# Altium schematic sheet Switcher_Charger.SchDoc
size B
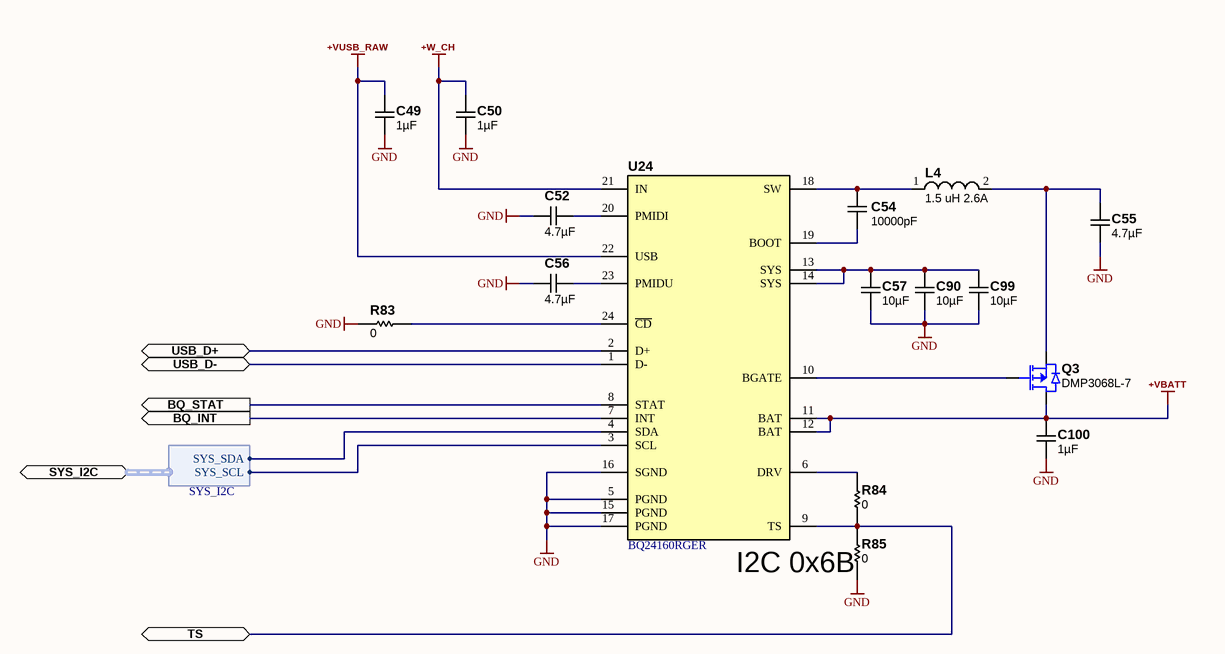
[diagram p0: Switcher_Charger.SchDoc]

## Parts
C49  1µF  [C0603_0.90MM_MD]
C50  1µF  [C0603_0.90MM_MD]
C52  4.7µF  [C0805_1.45MM_MD]
C54  10000pF  [C0603_0.90MM_MD]
C55  4.7µF  [C0805_1.45MM_MD]
C56  4.7µF  [C0805_1.45MM_MD]
C57  10µF  [C0805_1.40MM_MD]
C90  10µF  [C0805_1.40MM_MD]
C99  10µF  [C0805_1.40MM_MD]
C100  1µF  [C0603_0.90MM_MD]
L4  1.5 uH 2.6A  [L_DO1608C]
Q3  DMP3068L-7  [SOT-23]
R83  0  [R0603_0.55MM_MD]
R84  0  [R0603_0.55MM_MD]
R85  0  [R0603_0.55MM_MD]
U24  BQ24160RGER  [QFN50P400X400X100_HS-25N]

## Ports
BQ_INT (out), BQ_STAT (out), SYS_I2C (bidir, harness SYS_I2C), TS (bidir), USB_D+ (bidir), USB_D- (bidir)

## Harnesses
SYS_I2C: SYS_SCL, SYS_SDA

## Nets
+VBATT: C100.2 Q3.3(D) U24.11(BAT) U24.12(BAT)
+VUSB_RAW: C49.2 U24.22(USB)
+W_CH: C50.2 U24.21(IN)
GND: C49.1 C50.1 C52.2 C55.1 C56.2 C57.1 C90.1 C99.1 C100.1 R83.2 R85.1 U24.5(PGND) U24.15(PGND) U24.16(SGND) U24.17(PGND)
BQ_INT: U24.7(INT) ; port BQ_INT
BQ_STAT: U24.8(STAT) ; port BQ_STAT
TS: R84.1 R85.2 U24.9(TS) ; port TS
USB_D+: U24.2(D+) ; port USB_D+
USB_D-: U24.1(D-) ; port USB_D-
NetC52_1: C52.1 U24.20(PMIDI)
NetC54_1: C54.1 U24.19(BOOT)
NetC54_2: C54.2 L4.1 U24.18(SW)
NetC55_2: C55.2 L4.2 Q3.2(S)
NetC56_1: C56.1 U24.23(PMIDU)
NetC57_2: C57.2 C90.2 C99.2 U24.13(SYS) U24.14(SYS)
NetQ3_1: Q3.1(G) U24.10(BGATE)
NetR83_1: R83.1 U24.24(~{CD})
NetR84_2: R84.2 U24.6(DRV)
NetU24_3: U24.3(SCL) ; port SYS_I2C.SYS_SCL
NetU24_4: U24.4(SDA) ; port SYS_I2C.SYS_SDA

## Notes on the sheet
- (near U24) I2C 0x6B

## Library data of the parts
C49 C50 C100 = CGA3E1X7R1C105K080AC: CAP CER 1UF 16V X7R 0603; Manufacturer: TDK Corporation; Tolerance: ±10%; Substitution Notes: 1µF , 16V , ±10% , X7R , -55°C ~ 125°C , AEC-Q200 , 0603; Value: 1µF; Temperature Coefficient: X7R; Manufacturer Part Number: CGA3E1X7R1C105K080AC; ComponentLink1Description: Datasheet (Internal); ComponentLink1URL: datasheets\TDK\mlcc_automotive_general_en.pdf; ComponentLink2Description: Datasheet (External); ComponentLink2URL: https://product.tdk.com/info/en/catalog/datasheets/mlcc_automotive_general_en.pdf; Supplier 1: Digikey; Supplier Part Number 1: 445-12539-1-ND; Category: Capacitors; Voltage - Rated: 16V; Features: -; Operating Temperature: -55°C ~ 125°C; Ratings: AEC-Q200; Package: 0603; Thickness (Max): 0.90MM
C52 C55 C56 = CGA4J3X7R1C475K125AB: CAP CER 4.7UF 16V X7R 0805; Manufacturer: TDK Corporation; Tolerance: ±10%; Substitution Notes: 4.7µF , 16V , ±10% , X7R , -55°C ~ 125°C , AEC-Q200 , 0805; Value: 4.7µF; Temperature Coefficient: X7R; Manufacturer Part Number: CGA4J3X7R1C475K125AB; ComponentLink1Description: Datasheet (Internal); ComponentLink1URL: datasheets\TDK\mlcc_automotive_general_en.pdf; ComponentLink2Description: Datasheet (External); ComponentLink2URL: https://product.tdk.com/info/en/catalog/datasheets/mlcc_automotive_general_en.pdf; Supplier 1: Digikey; Supplier Part Number 1: 445-6969-1-ND; Category: Capacitors; Voltage - Rated: 16V; Features: -; Operating Temperature: -55°C ~ 125°C; Ratings: AEC-Q200; Package: 0805; Thickness (Max): 1.45MM
C54 = CGA3E2C0G1H103J080AA: CAP CER 10000PF 50V C0G 0603; Manufacturer: TDK Corporation; Temperature Coefficient: C0G, NP0; Tolerance: ±5%; Substitution Notes: 10000pF , 50V , ±5% , C0G, NP0 , -55°C ~ 125°C , AEC-Q200 , 0603; Value: 10000pF; Manufacturer Part Number: CGA3E2C0G1H103J080AA; ComponentLink1Description: Datasheet (Internal); ComponentLink1URL: datasheets\TDK\mlcc_automotive_general_en.pdf; ComponentLink2Description: Datasheet (External); ComponentLink2URL: https://product.tdk.com/info/en/catalog/datasheets/mlcc_automotive_general_en.pdf; Supplier 1: Digikey; Supplier Part Number 1: 445-6916-1-ND; Category: Capacitors; Voltage - Rated: 50V; Features: -; Operating Temperature: -55°C ~ 125°C; Ratings: AEC-Q200; Package: 0603; Thickness (Max): 0.90MM
C57 C90 C99 = GCM21BR71A106KE22L: CAP CER 10UF 10V X7R 0805; Manufacturer: Murata Electronics; Tolerance: ±10%; Value: 10µF; Temperature Coefficient: X7R; Manufacturer Part Number: GCM21BR71A106KE22L; ComponentLink1Description: Datasheet (Internal); ComponentLink1URL: https://search.murata.co.jp/Ceramy/image/img/A01X/G101/ENG/GCM21BR71A106KE22-01.pdf; ComponentLink2Description: Datasheet (External); ComponentLink2URL: https://search.murata.co.jp/Ceramy/image/img/A01X/G101/ENG/GCM21BR71A106KE22-01.pdf; Supplier 1: Digikey; Supplier Part Number 1: 490-10674-1-ND; Category: Capacitors; Voltage - Rated: 10V; Operating Temperature: -55°C ~ 125°C; Ratings: AEC-Q200; Package: 0805; Thickness (Max): 1.40MM
L4 = DO1608C-152ML: Manufacturer: Coilcraft; Part Number: DO1608C-152ML_; CategorySort: 300; Inductance (uH): 1.5; Tolerance: 20; DCR Max (Ohms): 0.06; SRF typ (MHz): 115; Isat (A): 2.6; IRMS (A) 20 rise: 1.9; IRMS (A) 40 rise: 2.65; Shielding: Unshielded; Category: Inductors; Value: 1.5 uH 2.6A; Manufacturer Part Number: DO1608C-152ML; ComponentLink1Description: Internal Datasheet; ComponentLink1URL: http://www.coilcraft.com/pdf_viewer/showpdf.cfm?f=pdf_store:do1608c.pdf; ComponentLink2Description: External Datasheet; ComponentLink2URL: http://www.coilcraft.com/pdf_viewer/showpdf.cfm?f=pdf_store:do1608c.pdf; Sort Value: 1.5; Sort Value Package: DO1608C_1.5; Supplier 1: Coilcraft; Supplier Part Number 1: DO1608C-152ML; Supplier Unit Price 1: 0.88; Package: DO1608C; Height (mm): 2.92
Q3 = DMP3068L-7: MOSFET P-CH 30V 3.9A SOT23; Manufacturer: Diodes; Continuous Drain Current (ID): 3.3A; Rds On Max: 72mR; Input Capacitance: 708pF; Max Power Dissipation: 700mW; Value: DMP3068L-7; Supplier 1: Digi-Key; Supplier Part Number 1: DMP3068L-7DIDKR-ND; Manufacturer Part Number: DMP3068L-7; Stock 1: 55860; Pricing 1: 1=0.52, 10=0.377, 100=0.2222, 500=0.12576, 1000=0.09642 (USD); Mount: Surface Mount; Case/Package: TO-236-3; Min Operating Temperature: -55°C; Max Operating Temperature: 150°C; Packaging: Tape and Reel; Drain to Source Voltage (Vdss): 30V
R83-R85 = ERJ-3GEY0R00V: RES 0.0 OHM 1/10W JUMP 0603 SMD; Manufacturer: Panasonic Electronic Components; Package Power: 0603  (0.1W); Power (Watts): 0.1W- 1/10W; Tolerance: Jumper; Limiting Element Voltage: 75; Maximum Overload Voltage: 150; Maximum Working Voltage: 0.0V; Substitution Notes: 0 , Jumper , 0603 , AEC-Q200; Value: 0; Manufacturer Part Number: ERJ-3GEY0R00V; ComponentLink1Description: Internal Datasheet; ComponentLink1URL: datasheets\Panasonic Electronic Components\AOA0000CE1.pdf; ComponentLink2Description: External Datasheet; ComponentLink2URL: http://industrial.panasonic.com/www-data/pdf/AOA0000/AOA0000CE1.pdf; Supplier 1: Digi-Key; Supplier Part Number 1: P0.0GCT-ND; Category: Resistors; Resistance (Ohms): 0; Composition: Thick Film; Features: -; Temperature Coefficient: -; Package: 0603 (1608 Metric); Supplier Package: 0603; Size / Dimension: 0.063" L x 0.031" W (1.60mm x 0.80mm); Height: 0.55MM; Number of Terminations: 2; Sort Value: 0; Sort Value Package: 603_0; Ratings: AEC-Q200
U24 = BQ24160RGER: Switching Battery Charger Li-Ion 2500mA 3.5V to 4.44V 24-Pin VQFN EP T/R; Manufacturer: Texas Instruments; Output Current: 2.5A; Min Supply Voltage: 4.2V; Max Supply Voltage: 10V; Min Input Voltage: 4V; Operating Supply Current: 15mA; Switching Frequency: 1.5MHz; Number of Cells: 1; Supplier: Mouser; Supplier Part Number: 595-BQ24160RGER; Manufacturer Part Number: BQ24160RGER; RoHS: Yes; Category: Battery Management; Stock: 2930; Pricing: 1=5.56000, 10=4.99000, 25=4.72000, 50=4.72000, 100=4.09000, 250=3.88000, 500=3.48000, 1000=2.97000, 3000=2.87000, 6000=2.77000, 10000=2.87000 (USD); Case/Package: VQFN EP; Pins: 24; Contact Plating: Gold; Min Operating Temperature: -40°C; Max Operating Temperature: 85°C; Output Voltage: 4.44V; Packaging: Tape and Reel; Package Quantity: 3000; Series: -; Radiation Hardening: No; Lead Free: Lead Free; RoHS Compliant: Yes; ComponentLink1URL: https://datasheet.ciiva.com/15115/getdatasheetpartid-517647-15115075.pdf?src-supplier=Verical; ComponentLink1Description: https://datasheet.ciiva.com/15115/getdatasheetpartid-517647-15115075.pdf?src-supplier=Verical; ComponentLink2URL: https://datasheet.ciiva.com/3214/bq24163-3214169.pdf?src-supplier=Avnet; ComponentLink2Description: https://datasheet.ciiva.com/3214/bq24163-3214169.pdf?src-supplier=Avnet; ComponentLink3URL: https://datasheet.ciiva.com/6612/bq24160-6612582.pdf?src-supplier=Digi-Key; ComponentLink3Description: https://datasheet.ciiva.com/6612/bq24160-6612582.pdf?src-supplier=Digi-Key